# Altium schematic sheet power.SchDoc
size A; SheetNumber: 1; SheetTotal: 6
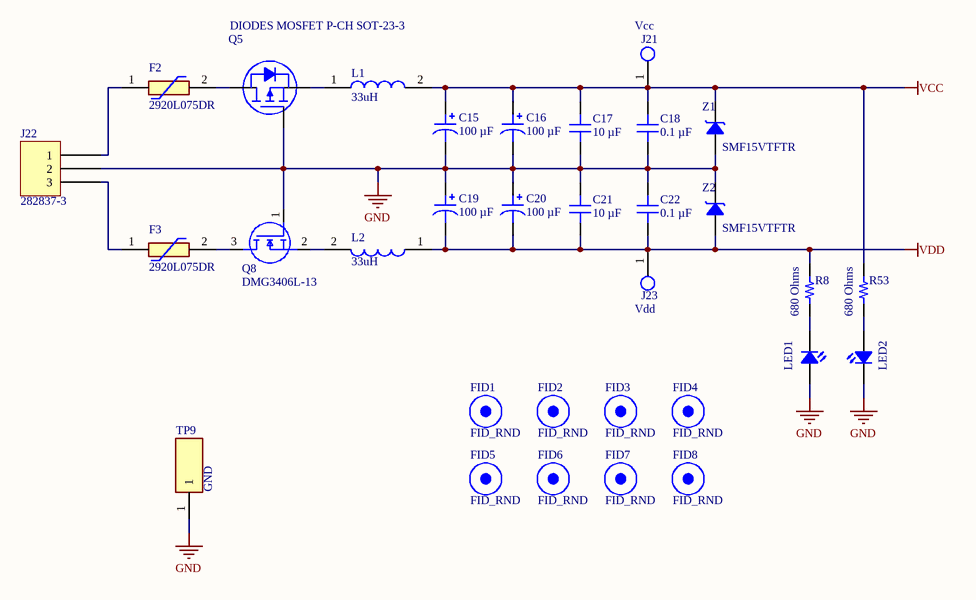
[diagram p0: power.SchDoc]

## Parts
C15  100 µF  [CAP ALSMD 8.3MM H10.5MM]
C16  100 µF  [CAP ALSMD 8.3MM H10.5MM]
C17  10 µF  [CAP 1206_3216 - 0.8MM]
C18  0.1 µF  [CAP 1206_3216 - 0.8MM]
C19  100 µF  [CAP ALSMD 8.3MM H10.5MM]
C20  100 µF  [CAP ALSMD 8.3MM H10.5MM]
C21  10 µF  [CAP 1206_3216 - 0.8MM]
C22  0.1 µF  [CAP 1206_3216 - 0.8MM]
F2  2920L075DR  [2920L030DR]
F3  2920L075DR  [2920L030DR]
FID1  FID_RND  [FID_RND]  (no BOM)
FID2  FID_RND  [FID_RND]  (no BOM)
FID3  FID_RND  [FID_RND]  (no BOM)
FID4  FID_RND  [FID_RND]  (no BOM)
FID5  FID_RND  [FID_RND]  (no BOM)
FID6  FID_RND  [FID_RND]  (no BOM)
FID7  FID_RND  [FID_RND]  (no BOM)
FID8  FID_RND  [FID_RND]  (no BOM)
J21  Vcc  [FP-5001-MFG]
J22  282837-3  [TE 282837-3]
J23  Vdd  [FP-5001-MFG]
L1  33uH  [INDPM116102X400N]
L2  33uH  [INDPM116102X400N]
LED1  LTST-C191KRKT  [LEDC1608X55N]  (value not drawn)
LED2  LTST-C191KRKT  [LEDC1608X55N]  (value not drawn)
Q5  DIODES MOSFET P-CH SOT-23-3  [DIODES SOT-23-3]
Q8  DMG3406L-13  [SOT96P240X110-3N]
R8  680 Ohms  [YAGEO RES 1206_3216]
R53  680 Ohms  [YAGEO RES 1206_3216]
TP9  GND  [S175146R]
Z1  SMF15VTFTR  [SMF15VTFTR]
Z2  SMF15VTFTR  [SMF15VTFTR]

## Nets
GND: C15.2 C16.2 C17.1 C18.1 C19.1 C20.1 C21.2 C22.2 J22.2 LED1.2(A) LED2.1(K) Q5.1(G) Q8.1(G) TP9.1 Z1.2 Z2.1
VCC: C15.1 C16.1 C17.2 C18.2 J21.1 L1.2 R53.2 Z1.1
VDD: C19.2 C20.2 C21.1 C22.1 J23.1 L2.1 R8.2 Z2.2
NetF2_1: F2.1 J22.1
NetF2_2: F2.2 Q5.3(D)
NetF3_1: F3.1 J22.3
NetF3_2: F3.2 Q8.3(D)
NetL1_1: L1.1 Q5.2(S)
NetL2_2: L2.2 Q8.2(S)
NetLED1_1: LED1.1(K) R8.1
NetLED2_2: LED2.2(A) R53.1

## Library data of the parts
C15 C16 C19 C20 = 50TZV100M8X10.5: CAP ALUM 100UF 20% 50V SMD; manufacturer: Rubycon; Impedance: 340 mOhms; Lifetime @ Temp.: 2000 Hrs @ 105°C; Polarization: Polar; Ripple Current @ High Frequency: 350 mA @ 100 kHz; Ripple Current @ Low Frequency: 175 mA @ 120 Hz; Surface Mount Land Size: 0.327" L x 0.327" W (8.30mm x 8.30mm); Part Number: 50TZV100M8X10.5; Applications: Automotive; Capacitance: 100 µF; componentlink1description: Datasheet; componentlink1url: http://www.rubycon.co.jp/en/catalog/e_pdfs/aluminum/e_tzv.pdf; componentlink2description: DigiKey Link; componentlink2url: https://www.digikey.com/en/products/detail/rubycon/50TZV100M8X10-5/3134931; Device Package: Radial, Can - SMD; Height - Seated (Max): 0.413" (10.50mm); lastupdated: 6/3/2024 20:15:48; Lifecycle Status: Active; Minimum Order: 1; Mounting Type: Surface Mount; Operating Temperature: -55°C ~ 105°C; Package / Case: Radial, Can - SMD; packaging: TapeAndReel; partid: 7533; Part Status: Active; price: 0.16; Ratings: AEC-Q200; series: TZV; Size / Dimension: 0.315" Dia (8.00mm); Supplier 1: DigiKey; Supplier Part Number 1: 1189-1651-1-ND; Tolerance: ±20%; value: 100 µF; Voltage - Rated: 50 V
C17 C21 = 885012208069: CAP CER 10UF 25V X7R 1206; manufacturer: Würth Elektronik; Tolerance: ±10%; Part Number: 885012208069; Capacitance: 10 µF; Applications: General Purpose; componentlink1description: Datasheet; componentlink1url: https://katalog.we-online.de/pbs/datasheet/885012208069.pdf; componentlink2description: DigiKey Link; componentlink2url: https://www.digikey.com/en/products/detail/würth-elektronik/885012208069/5453429; Device Package: 1206 (3216 Metric); lastupdated: 6/4/2024 19:10:32; Lifecycle Status: Active; Minimum Order: 1; Mounting Type: Surface Mount, MLCC; Operating Temperature: -55°C ~ 125°C; Package / Case: 1206 (3216 Metric); packaging: TapeAndReel; partid: 43199; Part Status: Active; price: 0.40; series: WCAP-CSGP; Size / Dimension: 0.126" L x 0.063" W (3.20mm x 1.60mm); Supplier 1: DigiKey; Supplier Part Number 1: 732-7574-1-ND; Temperature Coefficient: X7R; Thickness (Max): 0.075" (1.90mm); value: 10 µF; Voltage - Rated: 25V
C18 C22 = 885012208087: CAP CER 0.1UF 50V X7R 1206; manufacturer: Würth Elektronik; Tolerance: ±10%; Part Number: 885012208087; Capacitance: 0.1 µF; Applications: General Purpose; componentlink1description: Datasheet; componentlink1url: https://katalog.we-online.de/pbs/datasheet/885012208087.pdf; componentlink2description: DigiKey Link; componentlink2url: https://www.digikey.com/en/products/detail/würth-elektronik/885012208087/5453982; Device Package: 1206 (3216 Metric); lastupdated: 6/4/2024 19:10:27; Lifecycle Status: Active; Minimum Order: 1; Mounting Type: Surface Mount, MLCC; Operating Temperature: -55°C ~ 125°C; Package / Case: 1206 (3216 Metric); packaging: TapeAndReel; partid: 20879; Part Status: Active; price: 0.06; series: WCAP-CSGP; Size / Dimension: 0.126" L x 0.063" W (3.20mm x 1.60mm); Supplier 1: DigiKey; Supplier Part Number 1: 732-8127-1-ND; Temperature Coefficient: X7R; Thickness (Max): 0.035" (0.90mm); value: 0.1 µF; Voltage - Rated: 50V
F2 F3 = 2920L075DR: Resettable Fuse; Manufacturer_Name: LITTELFUSE; Datasheet Link: https://www.littelfuse.com/~/media/electronics/datasheets/resettable_ptcs/littelfuse_ptc_2920l_datasheet.pdf.pdf; Height: 1.25mm; Manufacturer_Part_Number: 2920L075DR; Mouser Part Number: 576-2920L075; Mouser Price/Stock: https://www.mouser.co.uk/ProductDetail/Littelfuse/2920L075DR?qs=SJZ%252BTX%252BI2BR6aMN5vUbCzw%3D%3D; Arrow Part Number: 2920L075DR; Arrow Price/Stock: https://www.arrow.com/en/products/2920l075dr/littelfuse?utm_currency=USD&region=europe
FID1-FID8 = CMP-0288-0A: Fiducial, Round, D=4mm (inner D=1mm); Manufacturer: KONČAR; ManufacturerPartNumber: FID_RND; MountingType: SMD; PartStatus: Active; ValueNumeric: FID_RND; Component Type: Mechanical Parts; Value: FID_RND
J21 J23 = 5001: PC TEST POINT MINIATURE BLACK; Body Material: Bronze; Plating: Silver; Inside Diameter: 1.27mm; Hole Diameter: 1.6mm; Number of Ports: 1; Outside Diameter: 2.54mm; Insulation: Insulated; Insulation Material: Nylon; Mount: Through Hole; RoHS Compliant: Yes; Series: THM; Height: 0.3inch; Termination: Through Hole; Material: Nylon; Packaging: Bulk; Contact Material: Bronze; REACH SVHC: No SVHC; Contact Plating: Silver; Orientation: Straight; Lead Free: Lead Free; Package Quantity: 100; Length: 7.62mm; Flammability Rating: UL94 V-0; Number of Contacts: 1; Diameter: 2.54mm; Housing Color: Black; Color: Black; Supplier 1: Mouser; Supplier Part Number 1: 534-5001
J22 = 282837-3: TERM BLK 3P SIDE ENT 5.08MM PCB; Manufacturer: TE Connectivity AMP Connectors; Current: 13.5 A; Mating Orientation: Horizontal with Board; Number of Levels: 1; Pitch: 0.200" (5.08mm); Positions Per Level: 3; Voltage: 300 V; Wire Gauge: 16-28 AWG; Wire Termination: Screw - Rising Cage Clamp; Part Number: 282837-3; Color: Green; ComponentLink1Description: Datasheet; ComponentLink1URL: https://www.te.com/commerce/DocumentDelivery/DDEController?Action=srchrtrv&DocNm=282837&DocType=Customer+Drawing&DocLang=English; ComponentLink2Description: DigiKey Link; ComponentLink2URL: https://www.digikey.com/en/products/detail/te-connectivity-amp-connectors/282837-3/2187974; Features: Interlocking (Side); LastUpdated: 6/21/2022 15:00:39; Lifecycle Status: Active; Minimum Order: 1; Mounting Type: Through Hole; Packaging: Tray; Part Status: Active; Price: 0.47; Series: Buchanan; Supplier 1: DigiKey; Supplier Part Number 1: A113321-ND
L1 L2 = AMRM00101040330MA1: Inductor; Manufacturer_Name: Pulse Electronics; Datasheet Link: https://productfinder.pulseelectronics.com/api/open/part-attachments/datasheet/amrm00101040330ma1; Height: 4mm; Manufacturer_Part_Number: AMRM00101040330MA1; Mouser Part Number: 673-AMRM101040330MA1; Mouser Price/Stock: https://www.mouser.co.uk/ProductDetail/Pulse-Electronics/AMRM00101040330MA1?qs=HoCaDK9Nz5eI6M5ad0CXDA%3D%3D; Value: 33uH
LED1 LED2 = LTST-C191KRKT: LED; Manufacturer_Name: Lite-On; Datasheet Link: http://www.mouser.com/ds/2/239/S_110_LTST-C191KRKT-539838.pdf; Height: 0.55mm; Manufacturer_Part_Number: LTST-C191KRKT; Mouser Part Number: 859-LTST-C191KRKT; Mouser Price/Stock: https://www.mouser.co.uk/ProductDetail/LITEON/LTST-C191KRKT?qs=BAIUz4Y8PJBLfOhzue0q%252BA%3D%3D; Arrow Part Number: LTST-C191KRKT; Arrow Price/Stock: https://www.arrow.com/en/products/ltst-c191krkt/lite-on-technology?utm_currency=USD&region=nac
Q5 = DMP3125L-7: MOSFET P-CH 30V 2.5A SOT23; Manufacturer: Diodes Incorporated; Current - Continuous Drain (Id) @ 25°C: 2.5A (Ta); Drive Voltage (Max Rds On,  Min Rds On): 4.5V, 10V; FET Type: P-Channel; Gate Charge (Qg) (Max) @ Vgs: 3.1 nC @ 4.5 V; Input Capacitance (Ciss) (Max) @ Vds: 254 pF @ 25 V; Power Dissipation (Max): 650mW (Ta); Rds On (Max) @ Id, Vgs: 95mOhm @ 3.8A, 10V; Vgs (Max): ±20V; Vgs(th) (Max) @ Id: 2.1V @ 250µA; Part Number: DMP3125L-7; ComponentLink1Description: Datasheet; ComponentLink1URL: https://www.diodes.com/assets/Datasheets/DMP3125L.pdf; ComponentLink2Description: DigiKey Link; ComponentLink2URL: https://www.digikey.com/en/products/detail/diodes-incorporated/DMP3125L-7/8275358; Drain to Source Voltage (Vdss): 30 V; LastUpdated: 6/3/2024 20:15:20; Lifecycle Status: Active; Minimum Order: 1; Mounting Type: Surface Mount; Operating Temperature: -55°C ~ 150°C (TJ); Package / Case: TO-236-3, SC-59, SOT-23-3; Packaging: TapeAndReel; Part Status: Active; Price: 0.05; Series: -; Supplier 1: DigiKey; Supplier Part Number 1: DMP3125L-7DICT-ND; Supplier Device Package: SOT-23-3; Technology: MOSFET (Metal Oxide)
Q8 = DMG3406L-13: MOSFET (N-Channel); Manufacturer_Name: Diodes Incorporated; Datasheet Link: https://www.diodes.com//assets/Datasheets/DMG3406L.pdf; Height: 1.1mm; Manufacturer_Part_Number: DMG3406L-13; Mouser Part Number: 621-DMG3406L-13; Mouser Price/Stock: https://www.mouser.co.uk/ProductDetail/Diodes-Incorporated/DMG3406L-13?qs=BvpHGKeVh3r%252BRZTTCOfjpg%3D%3D; Arrow Part Number: DMG3406L-13; Arrow Price/Stock: https://www.arrow.com/en/products/dmg3406l-13/diodes-incorporated?region=nac
R8 R53 = RT1206FRE07680RL: RES SMD 680 OHM 1% 1/4W 1206; Manufacturer: Yageo; Power (Watts): 0.25W, 1/4W; Temperature Coefficient: ±50ppm/°C; Part Number: RT1206FRE07680RL; ComponentLink1Description: Datasheet; ComponentLink1URL: https://www.yageo.com/upload/media/product/productsearch/datasheet/rchip/PYu-RT_1-to-0.01_RoHS_L_12.pdf; ComponentLink2Description: DigiKey Link; ComponentLink2URL: https://www.digikey.com/en/products/detail/yageo/RT1206FRE07680RL/1083328; Composition: Thin Film; Device Package: 1206 (3216 Metric); Height - Seated (Max): 0.026" (0.65mm); LastUpdated: 7/25/2024 09:21:22; Lifecycle Status: Active; Minimum Order: 1; Number of Terminations: 2; Operating Temperature: -55°C ~ 155°C; Package / Case: 1206 (3216 Metric); Packaging: TapeAndReel; PartId: 58036; Part Status: Active; Price: 0.01; Resistance: 680 Ohms; Series: RT; Size / Dimension: 0.122" L x 0.063" W (3.10mm x 1.60mm); Supplier 1: DigiKey; Supplier Part Number 1: 13-RT1206FRE07680RLCT-ND; Supplier Device Package: 1206; Tolerance: ±1%; Value: 680 Ohms
TP9 = S1751-46R: Test Point; Manufacturer_Name: Harwin; Datasheet Link: https://cdn.harwin.com/pdfs/S1751R.pdf; Height: 2mm; Manufacturer_Part_Number: S1751-46R; Mouser Part Number: 855-S1751-46R; Mouser Price/Stock: https://www.mouser.co.uk/ProductDetail/Harwin/S1751-46R?qs=l6ZPVqNVZb71wETAKrfRig%3D%3D
Z1 Z2 = SMF15VTFTR: Zener Diode; Manufacturer_Name: ROHM Semiconductor; Datasheet Link: https://fscdn.rohm.com/en/products/databook/datasheet/discrete/diode/zener/smf15vtftr-e.pdf; Height: 0.9mm; Manufacturer_Part_Number: SMF15VTFTR; Mouser Part Number: 755-SMF15VTFTR; Mouser Price/Stock: https://www.mouser.co.uk/ProductDetail/ROHM-Semiconductor/SMF15VTFTR?qs=HXFqYaX1Q2wU8NS9uLe0xg%3D%3D